# Altium schematic sheet Схема блока МК.SchDoc
size 420 x 297 mm; Address1: Address1; Address2: Address2; Address3: Address3; Address4: Address4; DocumentNumber: АБВГ.123456.001 Э3; SheetNumber: 1; Scale: 1:1; DocumentType: Схема электрическая принципиальная; FirstReferrence: АБВГ.123456.001
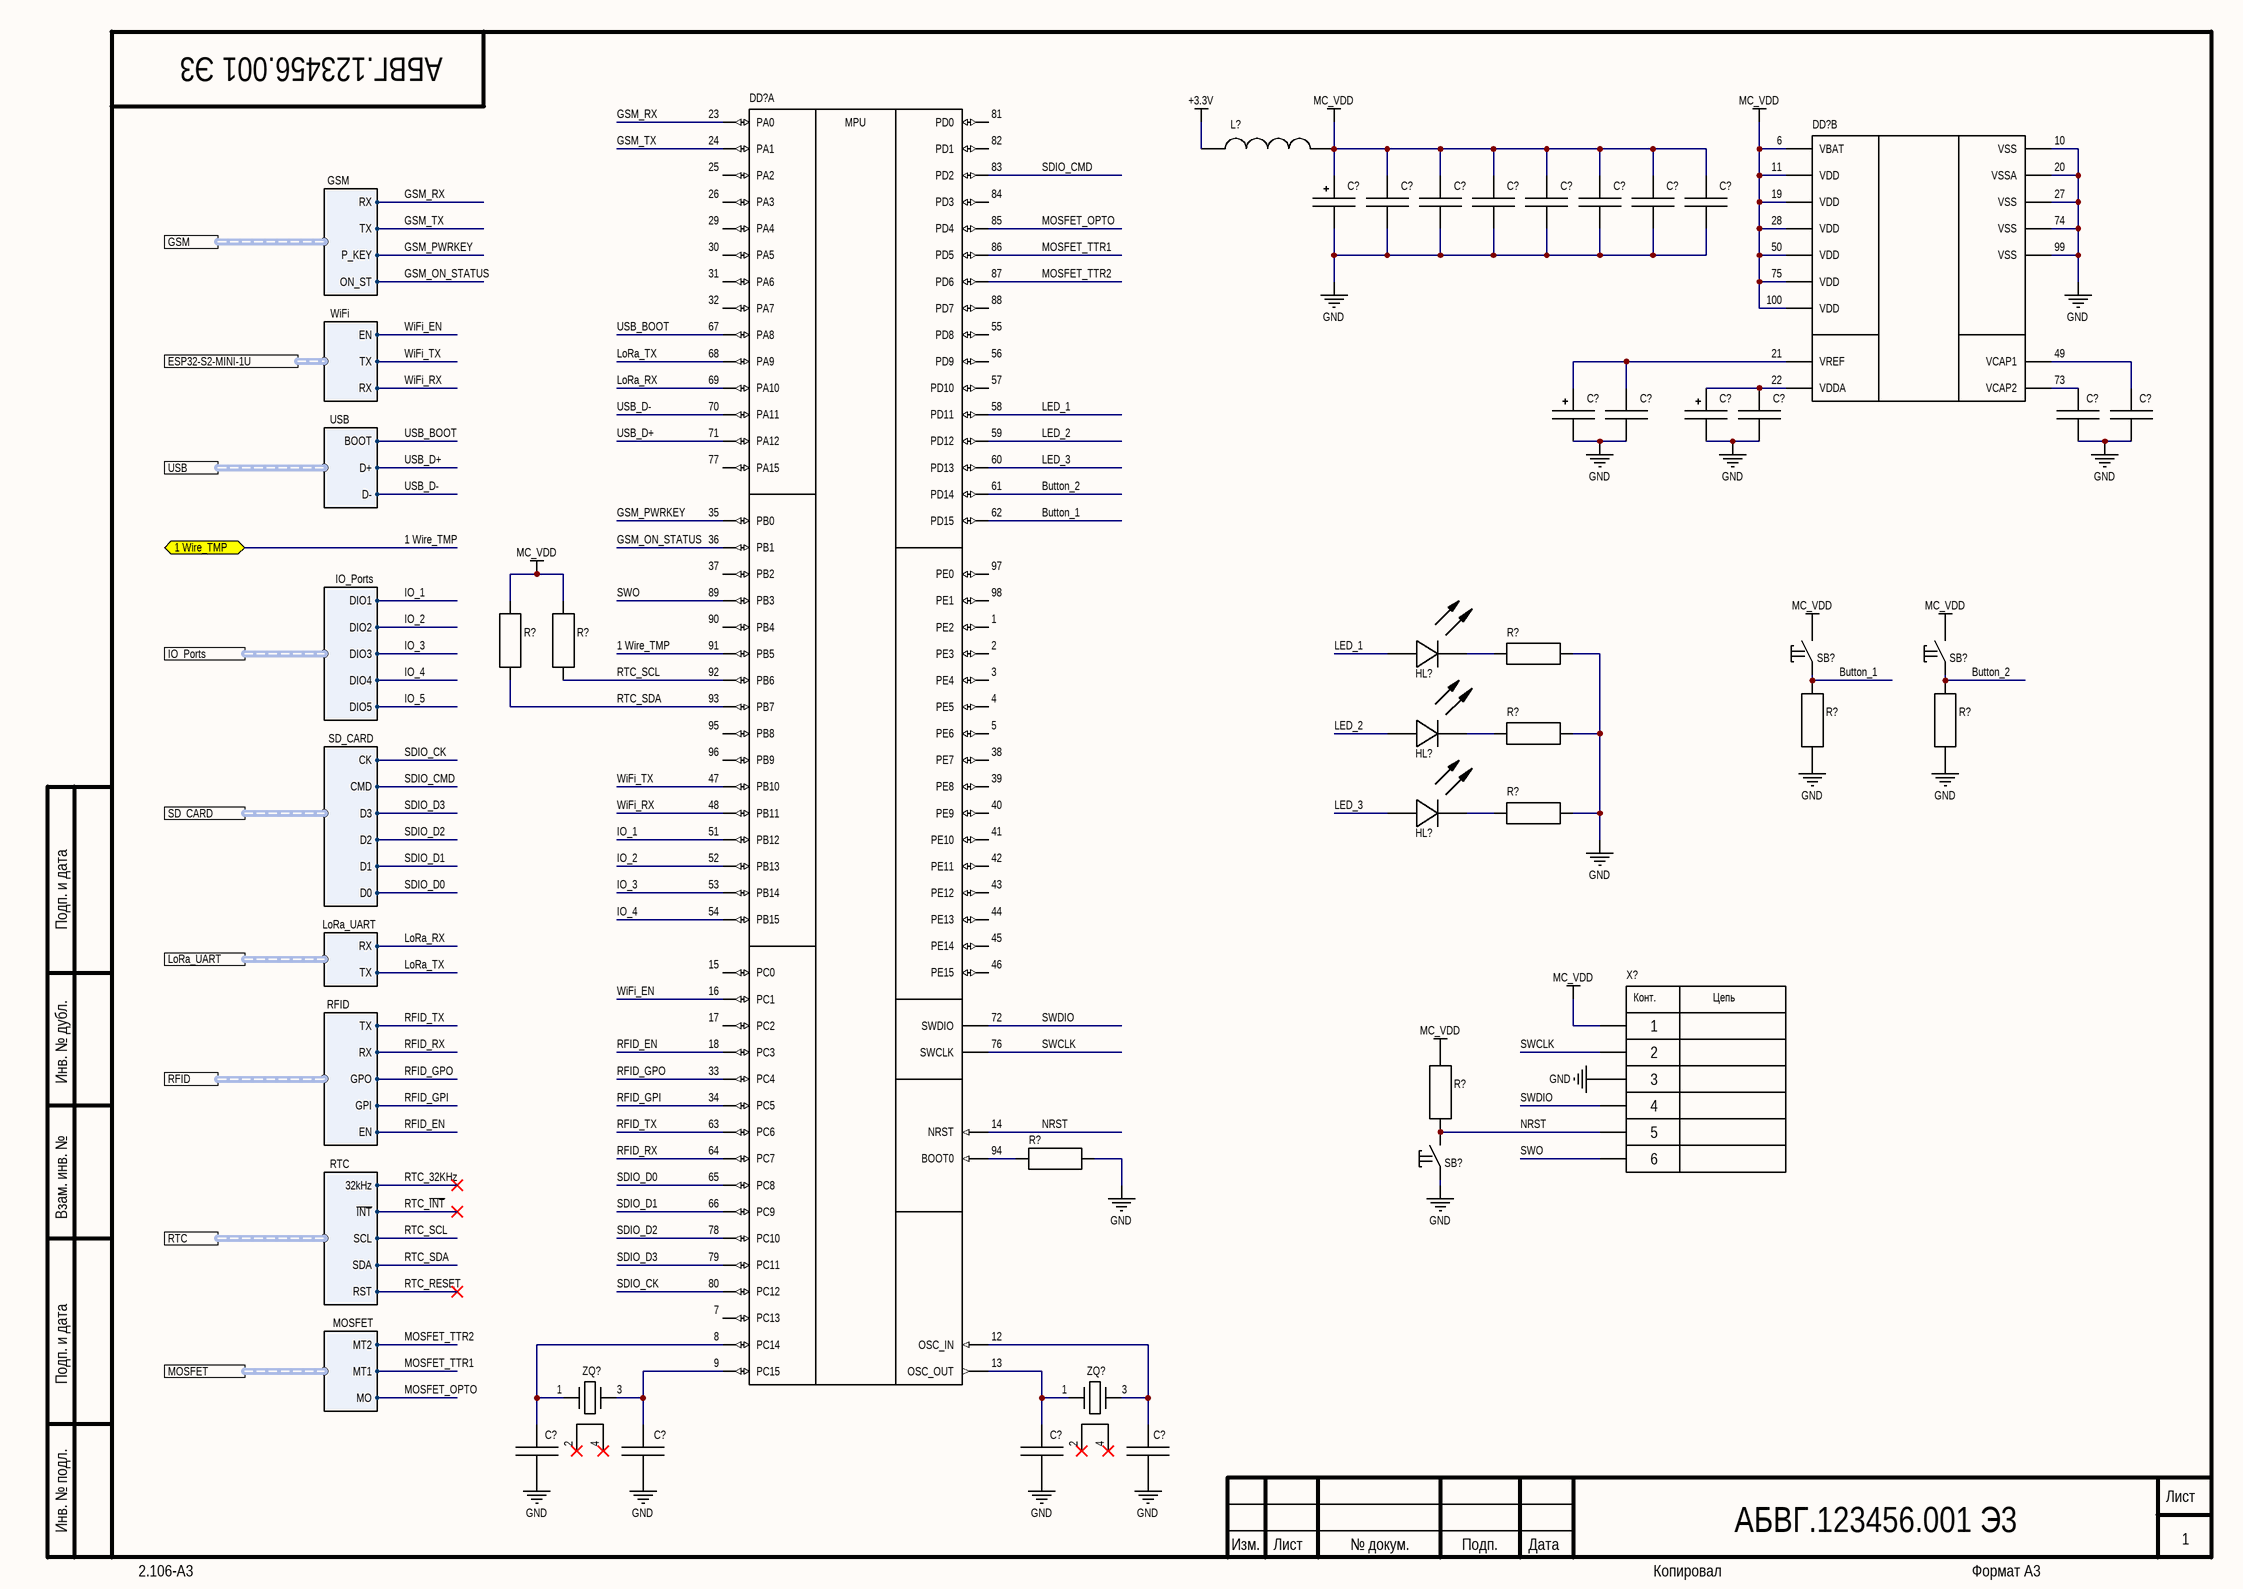
[diagram p0: Схема блока МК.SchDoc]

## Parts
(Parts that share a designator on the sheet are numbered #1, #2 ... from top to bottom, then left to right.)
C?#1  *  [TANTAL_A]  (value not drawn)
C?#2  *  [CH0603C]  (value not drawn)
C?#3  *  [CH0603C]  (value not drawn)
C?#4  *  [CH0603C]  (value not drawn)
C?#5  *  [CH0603C]  (value not drawn)
C?#6  *  [CH0603C]  (value not drawn)
C?#7  *  [CH0603C]  (value not drawn)
C?#8  *  [CH0603C]  (value not drawn)
C?#9  *  [TANTAL_A]  (value not drawn)
C?#10  *  [CH0603C]  (value not drawn)
C?#11  *  [TANTAL_A]  (value not drawn)
C?#12  *  [CH0603C]  (value not drawn)
C?#13  *  [CH0603C]  (value not drawn)
C?#14  *  [CH0603C]  (value not drawn)
C?#15  *  [CH0603C]  (value not drawn)
C?#16  *  [CH0603C]  (value not drawn)
C?#17  *  [CH0603C]  (value not drawn)
C?#18  *  [CH0603C]  (value not drawn)
DD?#1  STM32F407VGT6  [100-LQFP]  (value not drawn)  (part A of 2)
DD?#2  STM32F407VGT6  [100-LQFP]  (value not drawn)  (part B of 2)
HL?#1  *  [CH0805LG]  (value not drawn)
HL?#2  *  [CH0805LG]  (value not drawn)
HL?#3  *  [CH0805LG]  (value not drawn)
L?  *  [CH0603L]  (value not drawn)
R?#1  *  [CH0603R - without silc]  (value not drawn)
R?#2  *  [CH0603R]  (value not drawn)
R?#3  *  [CH0603R]  (value not drawn)
R?#4  *  [CH0603R - without silc]  (value not drawn)
R?#5  *  [CH0603R]  (value not drawn)
R?#6  *  [CH0603R]  (value not drawn)
R?#7  *  [CH0603R - without silc]  (value not drawn)
R?#8  *  [CH0603R]  (value not drawn)
R?#9  *  [CH0603R]  (value not drawn)
SB?#1  Tactile switches  [BUT: 6x6]  (value not drawn)
SB?#2  Tactile switches  [BUT: 6x6]  (value not drawn)
SB?#3  Tactile switches  [BUT: 6x6]  (value not drawn)
X?  *  [CON: PLS-6]  (value not drawn)
ZQ?#1  *  [OSC: 3215]  (value not drawn)
ZQ?#2  *  [OSC: ABM3]  (value not drawn)

## Ports
1 Wire_TMP (bidir), ESP32-S2-MINI-1U (harness WiFi), GSM (harness GSM), IO_Ports (harness IO_Ports), LoRa_UART (harness LoRa_UART), MOSFET (harness MOSFET), RFID (harness RFID), RTC (harness RTC), SD_CARD (harness SD_CARD), USB (harness USB)

## Harnesses
GSM: RX, TX, P_KEY, ON_ST
WiFi: EN, TX, RX
USB: BOOT, D+, D-
IO_Ports: DIO1, DIO2, DIO3, DIO4, DIO5
SD_CARD: CK, CMD, D3, D2, D1, D0
LoRa_UART: RX, TX
RFID: TX, RX, GPO, GPI, EN
RTC: 32kHz, ~{INT}, SCL, SDA, RST
MOSFET: MT2, MT1, MO

## Nets
+3.3V: L?.2
GND: C?#1.2 C?#2.2 C?#3.2 C?#4.2 C?#5.2 C?#6.2 C?#7.2 C?#8.2 C?#9.2 C?#10.2 C?#11.2 C?#12.2 C?#13.2 C?#14.2 C?#15.2 C?#16.2 C?#17.2 C?#18.2 DD?#2.10(VSS) DD?#2.20(VSSA) DD?#2.27(VSS) DD?#2.74(VSS) DD?#2.99(VSS) R?#1.2 R?#4.2 R?#5.1 R?#6.1 R?#7.2 R?#9.1 SB?#3.1 X?.3
MC_VDD: C?#1.1 C?#2.1 C?#3.1 C?#4.1 C?#5.1 C?#6.1 C?#7.1 C?#8.1 DD?#2.6(VBAT) DD?#2.11(VDD) DD?#2.19(VDD) DD?#2.28(VDD) DD?#2.50(VDD) DD?#2.75(VDD) DD?#2.100(VDD) L?.1 R?#2.2 R?#3.2 R?#8.2 SB?#1.2 SB?#2.2 X?.1
1 Wire_TMP: DD?#1.91(PB5) ; port 1 Wire_TMP
Button_1: DD?#1.62(PD15) R?#5.2 SB?#1.1
Button_2: DD?#1.61(PD14) R?#6.2 SB?#2.1
GSM_ON_STATUS: DD?#1.36(PB1) ; port GSM.ON_ST
GSM_PWRKEY: DD?#1.35(PB0) ; port GSM.P_KEY
GSM_RX: DD?#1.23(PA0) ; port GSM.RX
GSM_TX: DD?#1.24(PA1) ; port GSM.TX
IO_1: DD?#1.51(PB12) ; port IO_Ports.DIO1
IO_2: DD?#1.52(PB13) ; port IO_Ports.DIO2
IO_3: DD?#1.53(PB14) ; port IO_Ports.DIO3
IO_4: DD?#1.54(PB15) ; port IO_Ports.DIO4
IO_5: port IO_Ports.DIO5
LED_1: DD?#1.58(PD11) HL?#1.1(A)
LED_2: DD?#1.59(PD12) HL?#2.1(A)
LED_3: DD?#1.60(PD13) HL?#3.1(A)
LoRa_RX: DD?#1.69(PA10) ; port LoRa_UART.RX
LoRa_TX: DD?#1.68(PA9) ; port LoRa_UART.TX
MOSFET_OPTO: DD?#1.85(PD4) ; port MOSFET.MO
MOSFET_TTR1: DD?#1.86(PD5) ; port MOSFET.MT1
MOSFET_TTR2: DD?#1.87(PD6) ; port MOSFET.MT2
NRST: DD?#1.14(NRST) R?#8.1 SB?#3.2 X?.5
RFID_EN: DD?#1.18(PC3) ; port RFID.EN
RFID_GPI: DD?#1.34(PC5) ; port RFID.GPI
RFID_GPO: DD?#1.33(PC4) ; port RFID.GPO
RFID_RX: DD?#1.64(PC7) ; port RFID.RX
RFID_TX: DD?#1.63(PC6) ; port RFID.TX
RTC_32KHz: port RTC.32kHz
RTC_~{INT}: port RTC.~{INT}
RTC_RESET: port RTC.RST
RTC_SCL: DD?#1.92(PB6) R?#3.1 ; port RTC.SCL
RTC_SDA: DD?#1.93(PB7) R?#2.1 ; port RTC.SDA
SDIO_CK: DD?#1.80(PC12) ; port SD_CARD.CK
SDIO_CMD: DD?#1.83(PD2) ; port SD_CARD.CMD
SDIO_D0: DD?#1.65(PC8) ; port SD_CARD.D0
SDIO_D1: DD?#1.66(PC9) ; port SD_CARD.D1
SDIO_D2: DD?#1.78(PC10) ; port SD_CARD.D2
SDIO_D3: DD?#1.79(PC11) ; port SD_CARD.D3
SWCLK: DD?#1.76(SWCLK) X?.2
SWDIO: DD?#1.72(SWDIO) X?.4
SWO: DD?#1.89(PB3) X?.6
USB_BOOT: DD?#1.67(PA8) ; port USB.BOOT
USB_D+: DD?#1.71(PA12) ; port USB.D+
USB_D-: DD?#1.70(PA11) ; port USB.D-
WiFi_EN: DD?#1.16(PC1) ; port ESP32-S2-MINI-1U.EN
WiFi_RX: DD?#1.48(PB11) ; port ESP32-S2-MINI-1U.RX
WiFi_TX: DD?#1.47(PB10) ; port ESP32-S2-MINI-1U.TX
NetC?#9_1: C?#9.1 C?#10.1 DD?#2.21(VREF)
NetC?#11_1: C?#11.1 C?#12.1 DD?#2.22(VDDA)
NetC?#13_1: C?#13.1 DD?#2.73(VCAP2)
NetC?#14_1: C?#14.1 DD?#2.49(VCAP1)
NetC?#15_1: C?#15.1 DD?#1.8(PC14) ZQ?#1.1
NetC?#16_1: C?#16.1 DD?#1.9(PC15) ZQ?#1.3
NetC?#17_1: C?#17.1 DD?#1.13(OSC_OUT) ZQ?#2.1
NetC?#18_1: C?#18.1 DD?#1.12(OSC_IN) ZQ?#2.3
NetDD?#1_94: DD?#1.94(BOOT0) R?#9.2
NetHL?#1_2: HL?#1.2(C) R?#1.1
NetHL?#2_2: HL?#2.2(C) R?#4.1
NetHL?#3_2: HL?#3.2(C) R?#7.1

Not connected (* = marked no-connect by the designer): DD?#1 1(PE2) 2(PE3) 3(PE4) 4(PE5) 5(PE6) 7(PC13) 15(PC0) 17(PC2) 25(PA2) 26(PA3) 29(PA4) 30(PA5) 31(PA6) 32(PA7) 37(PB2) 38(PE7) 39(PE8) 40(PE9) 41(PE10) 42(PE11) 43(PE12) 44(PE13) 45(PE14) 46(PE15) 55(PD8) 56(PD9) 57(PD10) 77(PA15) 81(PD0) 82(PD1) 84(PD3) 88(PD7) 90(PB4) 95(PB8) 96(PB9) 97(PE0) 98(PE1); ZQ?#1 2* 4*; ZQ?#2 2* 4*

## Notes on the sheet
- Подп. и дата
- Инв. № дубл.
- Взам. инв. №
- Инв. № подл.
- Изм.
- Лист
- № докум.
- Подп.
- Дата
- 2.106-A3
- Копировал
- Формат А3
- (in symbol 6-Connector) Конт.; Цепь
- (in symbol STM32F407VGT6, part A) MPU

## Library data of the parts
C?#1 C?#9 C?#11 = TantalCap: Manufacturer: *; Model: *; HelpURL: *; ComponentKind: *; Value: *
C?#2-C?#8 C?#10 C?#12-C?#18 = Capacitor: Manufacturer: *; Model: *; HelpURL: *; ComponentKind: *; Value: *
DD?#1 = STM32F407VGT6: Cortex-M4; Manufacturer: STMicroelectronics; Model: STM32F407VGT6; HelpURL: https://www.digikey.com/en/products/detail/stmicroelectronics/STM32F407VGT6/2747117; ComponentKind: 100-LQFP; Supplier 1: Digi-Key; Supplier Part Number 1: 497-11605-ND
DD?#2 = STM32F407VGT6: Cortex-M4; Manufacturer: STMicroelectronics; Model: STM32F407VET6; HelpURL: https://www.digikey.com/product-detail/en/stmicroelectronics/STM32F407VET6/497-12075-ND/2793093; ComponentKind: 100-LQFP
HL?#1-HL?#3 = LED: Manufacturer: *; Model: *; HelpURL: *; ComponentKind: *; Value: *
L? = Inductor: Manufacturer: *; Model: *; HelpURL: https://www.digikey.com/en/products/detail/murata-electronics/BLM18AG102SN1D/584226?s=N4IgTCBcDaIEIBkCyBGAHAQQOIoAxgGUA5FAERAF0BfIA; ComponentKind: *; Value: *; Supplier 1: RSComponents; Supplier Part Number 1: 2303783
R?#1-R?#9 = Resistor: Manufacturer: *; Model: *; HelpURL: *; ComponentKind: *; Value: *
SB?#1-SB?#3 = Tactile switches: 6x6 mm; Manufacturer: *; Model: *; HelpURL: *; ComponentKind: *
X? = 6-Connector: Model: *; Manufacturer: *; HelpURL: *; ComponentKind: *
ZQ?#1 ZQ?#2 = Oscillator: Manufacturer: *; Model: *; HelpURL: *; ComponentKind: *; Value: *